# Altium schematic sheet microcontroller.SchDoc
size A
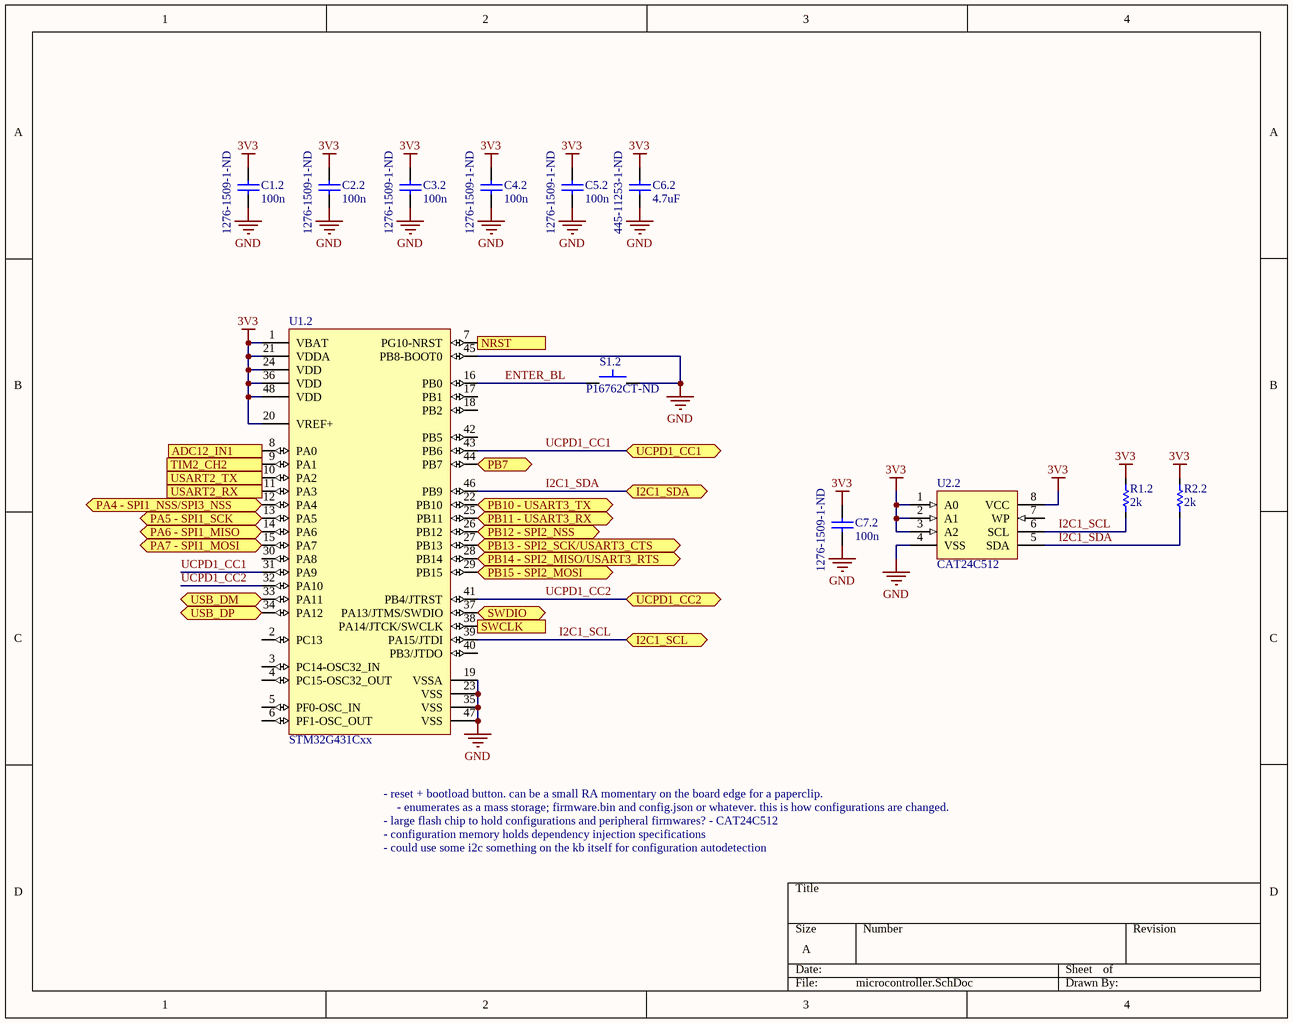
[diagram p0: microcontroller.SchDoc]

## Parts
C1.2  Supplier Part Number 1: 1276-1509-1-ND  [0402]  (hidden comment: 100n)
C2.2  Supplier Part Number 1: 1276-1509-1-ND  [0402]  (hidden comment: 100n)
C3.2  Supplier Part Number 1: 1276-1509-1-ND  [0402]  (hidden comment: 100n)
C4.2  Supplier Part Number 1: 1276-1509-1-ND  [0402]  (hidden comment: 100n)
C5.2  Supplier Part Number 1: 1276-1509-1-ND  [0402]  (hidden comment: 100n)
C6.2  4.7uF  Supplier Part Number 1: 445-11253-1-ND  [1608[0603]]
C7.2  Supplier Part Number 1: 1276-1509-1-ND  [0402]  (hidden comment: 100n)
R1.2  2k  [0402]
R2.2  2k  [0402]
S1.2  Supplier Part Number 1: P16762CT-ND  [EVQ-P6D/P]  (hidden comment: MOM_SWITCH)
U1.2  STM32G431Cxx  [TSQFP50P900X900X160-48N]
U2.2  CAT24C512  [TSOP65P640X120-8N]

## Ports
ADC12_IN1 (in), I2C1_SCL (bidir), I2C1_SDA (bidir), NRST (in), PA4 - SPI1_NSS/SPI3_NSS (bidir), PA5 - SPI1_SCK (bidir), PA6 - SPI1_MISO (bidir), PA7 - SPI1_MOSI (bidir), PB7 (bidir), PB10 - USART3_TX (bidir), PB11 - USART3_RX (bidir), PB12 - SPI2_NSS (bidir), PB13 - SPI2_SCK/USART3_CTS (bidir), PB14 - SPI2_MISO/USART3_RTS (bidir), PB15 - SPI2_MOSI (bidir), SWCLK (in), SWDIO (bidir), TIM2_CH2 (out), UCPD1_CC1 (bidir), UCPD1_CC2 (bidir), USART2_RX (in), USART2_TX (out), USB_DM (bidir), USB_DP (bidir)

## Nets
3V3: C1.2.1 C2.2.1 C3.2.1 C4.2.1 C5.2.1 C6.2.2 C7.2.1 R1.2.2 R2.2.2 U1.2.1(VBAT) U1.2.20(VREF+) U1.2.21(VDDA) U1.2.24(VDD) U1.2.36(VDD) U1.2.48(VDD) U2.2.1(A0) U2.2.2(A1) U2.2.3(A2) U2.2.8(VCC)
GND: C1.2.2 C2.2.2 C3.2.2 C4.2.2 C5.2.2 C6.2.1 C7.2.2 S1.2.2 U1.2.19(VSSA) U1.2.23(VSS) U1.2.35(VSS) U1.2.45(PB8-BOOT0) U1.2.47(VSS) U2.2.4(VSS)
ADC12_IN1: U1.2.8(PA0) ; port ADC12_IN1
ENTER_BL: S1.2.1 U1.2.16(PB0)
I2C1_SCL: R1.2.1 U1.2.39(PA15/JTDI) U2.2.6(SCL) ; port I2C1_SCL
I2C1_SDA: R2.2.1 U1.2.46(PB9) U2.2.5(SDA) ; port I2C1_SDA
NRST: U1.2.7(PG10-NRST) ; port NRST
PA4 - SPI1_NSS/SPI3_NSS: U1.2.12(PA4) ; port PA4 - SPI1_NSS/SPI3_NSS
PA5 - SPI1_SCK: U1.2.13(PA5) ; port PA5 - SPI1_SCK
PA6 - SPI1_MISO: U1.2.14(PA6) ; port PA6 - SPI1_MISO
PA7 - SPI1_MOSI: U1.2.15(PA7) ; port PA7 - SPI1_MOSI
PB7: U1.2.44(PB7) ; port PB7
PB10 - USART3_TX: U1.2.22(PB10) ; port PB10 - USART3_TX
PB11 - USART3_RX: U1.2.25(PB11) ; port PB11 - USART3_RX
PB12 - SPI2_NSS: U1.2.26(PB12) ; port PB12 - SPI2_NSS
PB13 - SPI2_SCK/USART3_CTS: U1.2.27(PB13) ; port PB13 - SPI2_SCK/USART3_CTS
PB14 - SPI2_MISO/USART3_RTS: U1.2.28(PB14) ; port PB14 - SPI2_MISO/USART3_RTS
PB15 - SPI2_MOSI: U1.2.29(PB15) ; port PB15 - SPI2_MOSI
SWCLK: U1.2.38(PA14/JTCK/SWCLK) ; port SWCLK
SWDIO: U1.2.37(PA13/JTMS/SWDIO) ; port SWDIO
TIM2_CH2: U1.2.9(PA1) ; port TIM2_CH2
UCPD1_CC1: U1.2.31(PA9) U1.2.43(PB6) ; port UCPD1_CC1
UCPD1_CC2: U1.2.32(PA10) U1.2.41(PB4/JTRST) ; port UCPD1_CC2
USART2_RX: U1.2.11(PA3) ; port USART2_RX
USART2_TX: U1.2.10(PA2) ; port USART2_TX
USB_DM: U1.2.33(PA11) ; port USB_DM
USB_DP: U1.2.34(PA12) ; port USB_DP

Not connected (* = marked no-connect by the designer): U1.2 2(PC13) 3(PC14-OSC32_IN) 4(PC15-OSC32_OUT) 5(PF0-OSC_IN) 6(PF1-OSC_OUT) 17(PB1) 18(PB2) 30(PA8) 40(PB3/JTDO) 42(PB5); U2.2 7(WP)

## Notes on the sheet
- - reset + bootload button. can be a small RA momentary on the board edge for a paperclip.
- - large flash chip to hold configurations and peripheral firmwares? - CAT24C512
- - configuration memory holds dependency injection specifications
- - enumerates as a mass storage; firmware.bin and config.json or whatever. this is how configurations are changed.
- - could use some i2c something on the kb itself for configuration autodetection

## Library data of the parts
C1.2 C2.2 C3.2 C4.2 C5.2 C7.2 = CAPACITOR NON_POL: Value: 100n; Supplier 1: Digi-Key
C6.2 = C0402: Value: 4.7uF; Supplier 1: Digi-Key
R1.2 R2.2 = RESISTOR: Manufacturer: Yageo; Manufacturer Part Number: RC0402JR-072KL; Tolerance: ±5%; Power (Watts): 0.063W, 1/16W; Temperature Coefficient: ±100ppm/°C; Value: 2k; Supplier 1: Digi-Key; Supplier Part Number 1: 311-2.0KJRCT-ND; Pricing 1: 1=0.1, 10=0.012, 25=0.0084, 100=0.0047, 250=0.0036, 500=0.0029, 1000=0.00213, 2500=0.00185, 5000=0.00153 (USD); Packaging: Cut Tape (CT); Resistance (Ohms): 2k; Composition: Thick Film; Features: Moisture Resistant; Operating Temperature: -55°C ~ 155°C; Package / Case: 0402 (1005 Metric); Supplier Device Package: 0402; Size / Dimension: 0.039" L x 0.020" W (1.00mm x 0.50mm); Height: 0.016" (0.40mm); Number of Terminations: 2; ComponentLink1URL: http://www.yageo.com/documents/recent/PYu-RC_Group_51_RoHS_L_04.pdf; ComponentLink1Description: http://www.yageo.com/documents/recent/PYu-RC_Group_51_RoHS_L_04.pdf
S1.2 = MOM_SWITCH: Momentary switch; Supplier 1: Digi-Key